# EAGLE design adsr (EAGLE 9.6.2)
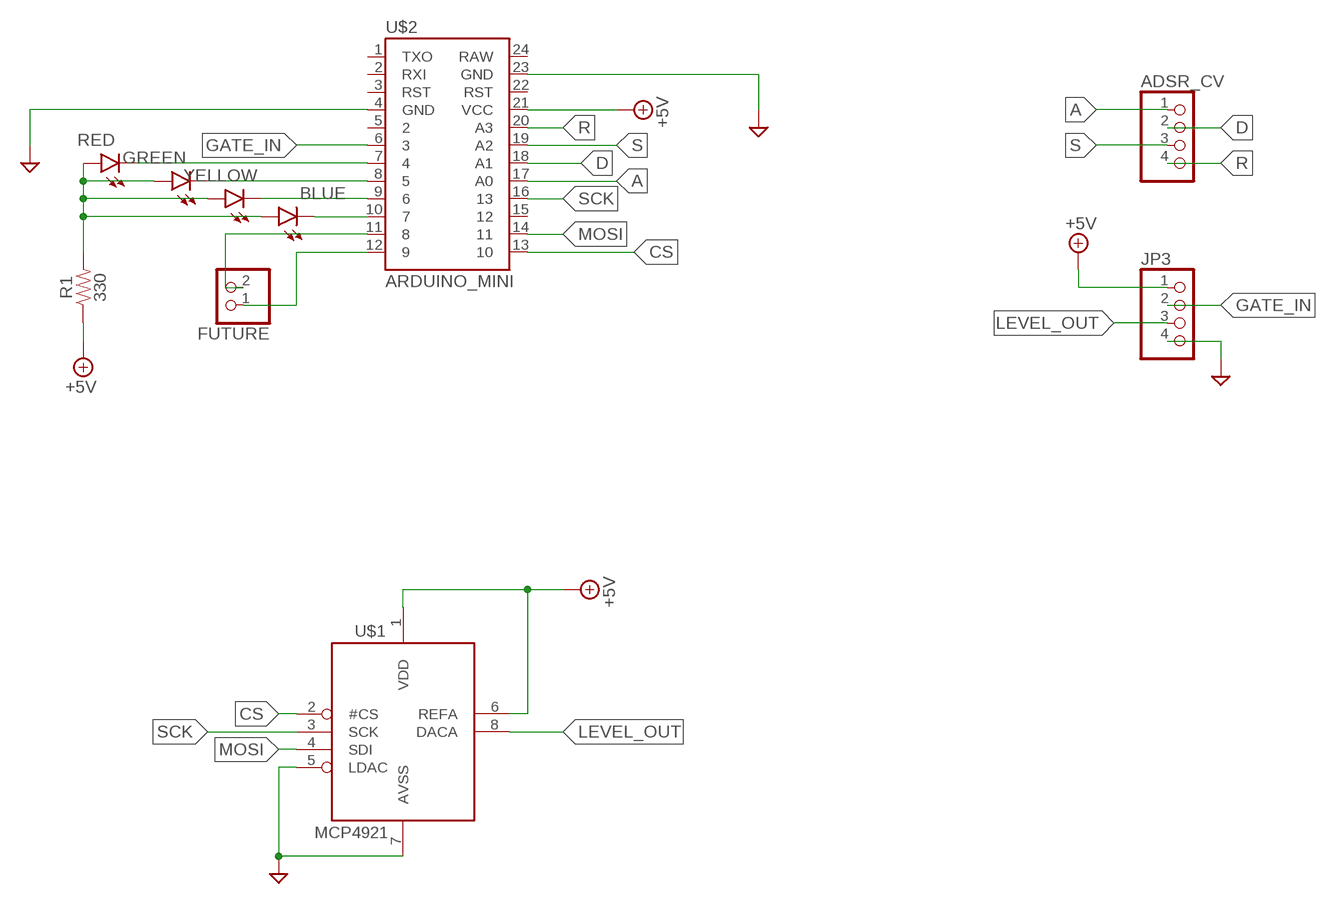
[diagram p0: schematic, sheet 1]

## Parts
ADSR_CV  PINHD-1X4  [1X04]
BLUE  LED-5MM-KIT-NO-SILK  [LED_5MM-KIT-NO-SILK]
FUTURE  PINHD-1X2  [1X02]
GREEN  LED-5MM-KIT-NO-SILK  [LED_5MM-KIT-NO-SILK]
JP3  PINHD-1X4  [1X04]
R1  330  330OHM-HORIZ-1/10W-5%  [AXIAL-0.3]
RED  LED-5MM-KIT-NO-SILK  [LED_5MM-KIT-NO-SILK]
U$1  MCP4921  [DIL08]
U$2  ARDUINO_MINI  [ARDUINO_MINI]
YELLOW  LED-5MM-KIT-NO-SILK  [LED_5MM-KIT-NO-SILK]

## Nets
+5V: JP3.1 R1.P$1 U$1.1(VDD) U$1.6(REFA) U$2.21(VCC)
A: ADSR_CV.1 U$2.17(A0)
CS: U$1.2(#CS) U$2.13
D: ADSR_CV.2 U$2.18(A1)
GATE_IN: JP3.2 U$2.6
GND: JP3.4 U$1.5(LDAC) U$1.7(AVSS) U$2.4(GND) U$2.23(GND)
LEVEL_OUT: JP3.3 U$1.8(DACA)
MOSI: U$1.4(SDI) U$2.14
N$4: BLUE.K(C) U$2.10
N$5: U$2.9 YELLOW.K(C)
N$6: GREEN.K(C) U$2.8
N$7: RED.K(C) U$2.7
N$8: BLUE.A GREEN.A R1.P$2 RED.A YELLOW.A
N$9: FUTURE.2 U$2.11
N$10: FUTURE.1 U$2.12
R: ADSR_CV.4 U$2.20(A3)
S: ADSR_CV.3 U$2.19(A2)
SCK: U$1.3(SCK) U$2.16
Unconnected: U$2.1(TXO) U$2.2(RXI) U$2.3(RST) U$2.5 U$2.15 U$2.22(RST) U$2.24(RAW)

## Library data of the parts
ADSR_CV JP3 = pinhead:PINHD-1X4: PIN HEADER
BLUE GREEN RED YELLOW = SparkFun-LED:LED: LED (Generic) Standard schematic elements and footprints for 5mm, 3mm, 1206, and 0603 sized LEDs. Generic LEDs with no color specified.
FUTURE = pinhead:PINHD-1X2: PIN HEADER
R1 = SparkFun-Resistors:330OHM: 330Ω resistor A resistor is a passive two-terminal electrical component that implements electrical resistance as a circuit element. Resistors act to reduce current flow, and, at the same time, act to lower voltage levels within circuits. - Wikipedia; PROD_ID: RES-8371
U$1 = adafruit:MCP4921
U$2 = SparkFun-Retired:ARDUINO_MINI: Arduino Pro Mini footprint

## Board
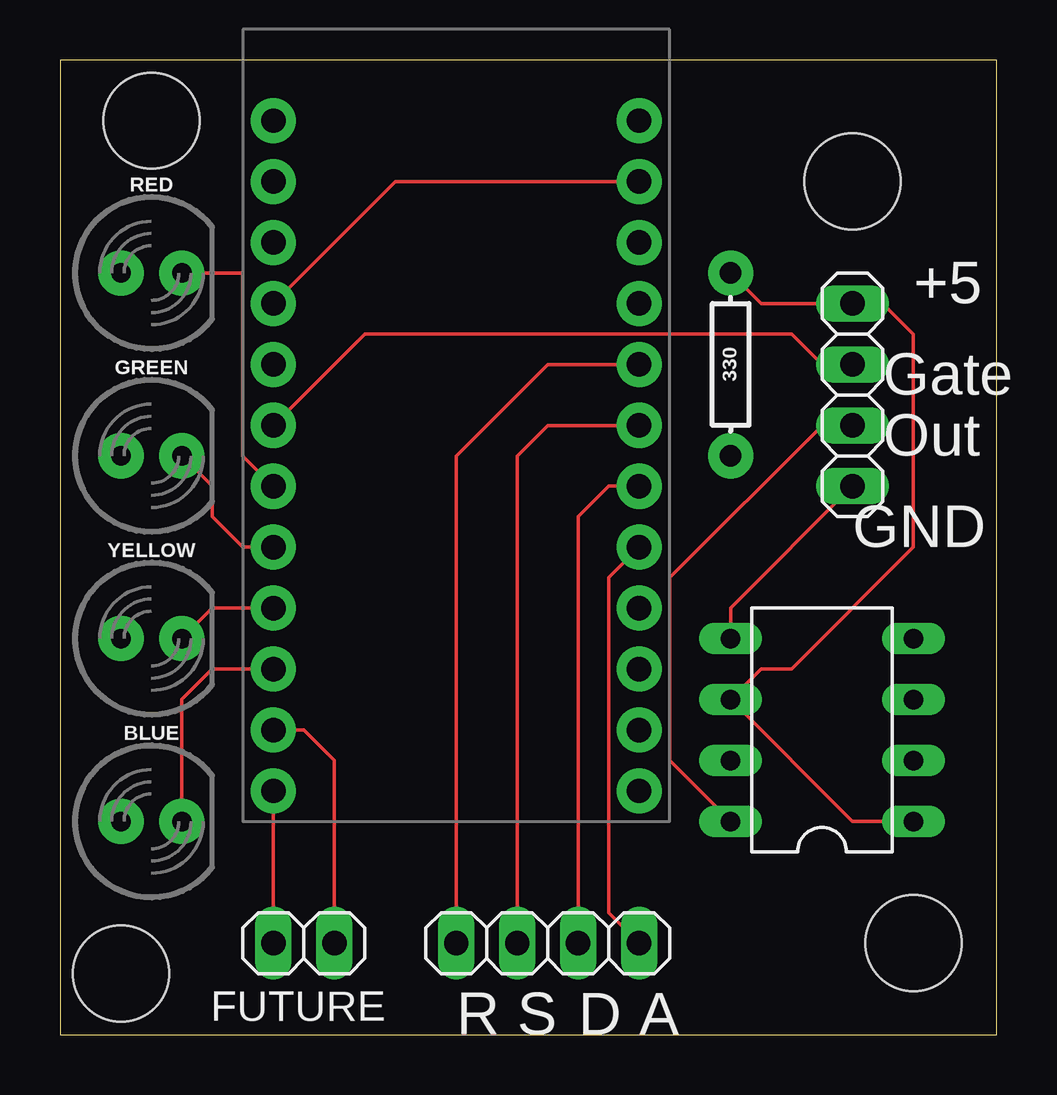
[diagram p1: board, top side]
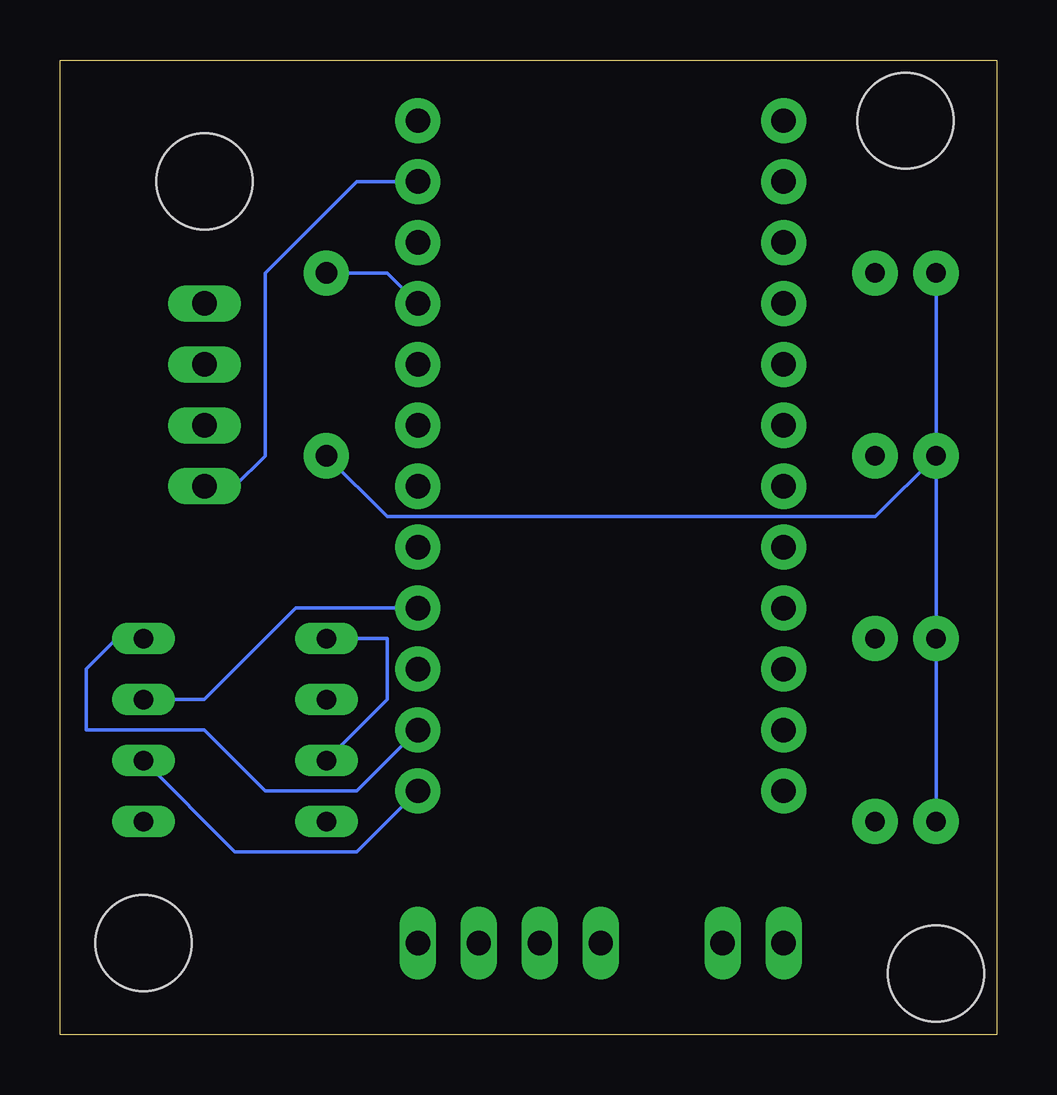
[diagram p2: board, bottom side, seen from below]

Size 39.04 x 40.63 mm. Coordinates in mm from the lower left corner, seen from the top.
Outline: 0,0 39.04,0 39.04,40.63 0,40.63 0,0
Copper layers (1*16): Top 0.035mm / dielectric 1.5mm / Bottom 0.035mm
Design rules "default": minimum track width 6mil, minimum drill 0.35mm, track to track 6mil, track to pad 6mil, pad to pad 6mil, via to via 6mil, smd to smd 6mil, copper to edge 40mil, drill to drill 6mil, minimum pad ring 10mil, minimum via ring 8mil, stop-mask expansion 4mil, vias tented up to drill 0mil, thermal gap 10mil
Holes 4 mm at 3.81,38.1 2.54,2.54 35.56,3.81 33.02,35.56

### Footprints (pad centres in the part's own frame; a part is rotated, then mirrored left to right if it is on the bottom)
1X04 = drill 1.016 long: 1 -3.81,0; 2 -1.27,0; 3 1.27,0; 4 3.81,0
LED_5MM-KIT-NO-SILK = drill 0.813 pad 1.88: A -1.27,0; K 1.27,0
1X02 = drill 1.016 long: 1 -1.27,0; 2 1.27,0
AXIAL-0.3 = drill 0.9 pad 1.88: P$1 -3.81,0; P$2 3.81,0
DIL08 = drill 0.813 long: 1 -3.81,-3.81; 2 -1.27,-3.81; 3 1.27,-3.81; 4 3.81,-3.81; 5 3.81,3.81; 6 1.27,3.81; 7 -1.27,3.81; 8 -3.81,3.81
ARDUINO_MINI = drill 1.016 pad 1.88: 1 -7.62,12.7; 2 -7.62,10.16; 3 -7.62,7.62; 4 -7.62,5.08; 5 -7.62,2.54; 6 -7.62,0; 7 -7.62,-2.54; 8 -7.62,-5.08; 9 -7.62,-7.62; 10 -7.62,-10.16; 11 -7.62,-12.7; 12 -7.62,-15.24; 13 7.62,-15.24; 14 7.62,-12.7; 15 7.62,-10.16; 16 7.62,-7.62; 17 7.62,-5.08; 18 7.62,-2.54; 19 7.62,0; 20 7.62,2.54; 21 7.62,5.08; 22 7.62,7.62; 23 7.62,10.16; 24 7.62,12.7

### Placement (x,y rotation side)
ADSR_CV  20.32,3.81 180 top
BLUE  3.81,8.89 0 top
FUTURE  10.16,3.81 0 top
GREEN  3.81,24.13 0 top
JP3  33.02,26.67 270 top
R1  27.94,27.94 270 top
RED  3.81,31.75 0 top
U$1  31.75,12.7 90 top
U$2  16.51,25.4 0 top
YELLOW  3.81,16.51 0 top

### Tracks (layer width: path | path; a pad name or v marks a point on that pad's centre or on a via)
+5V
  Top 0.152: U$1.1 33.02,8.89 U$1.6 29.21,15.24 30.48,15.24 35.56,20.32 35.56,29.21 34.29,30.48 JP3.1 29.21,30.48 R1.P$1
  Bottom 0.152: U$2.21 25.4,31.75 R1.P$1
A
  Top 0.152: U$2.17 22.86,19.05 22.86,5.08 ADSR_CV.1
CS
  Bottom 0.152: U$1.2 31.75,7.62 26.67,7.62 U$2.13
D
  Top 0.152: ADSR_CV.2 21.59,21.59 22.86,22.86 U$2.18
GATE_IN
  Top 0.152: JP3.2 31.75,27.94 30.48,29.21 12.7,29.21 U$2.6
GND
  Top 0.152: U$2.4 13.97,35.56 U$2.23 | U$1.5 27.94,17.78 JP3.4
  Bottom 0.152: JP3.4 31.75,22.86 30.48,24.13 30.48,31.75 26.67,35.56 U$2.23 | U$1.5 25.4,16.51 25.4,13.97 U$1.7
LEVEL_OUT
  Top 0.152: U$1.8 25.4,11.43 25.4,19.05 31.75,25.4 JP3.3
MOSI
  Bottom 0.152: U$2.14 26.67,10.16 30.48,10.16 33.02,12.7 37.95,12.7 37.95,15.24 36.68,16.51 U$1.4
N$4
  Top 0.152: BLUE.K 5.08,13.97 6.35,15.24 U$2.10
N$5
  Top 0.152: YELLOW.K 6.35,17.78 U$2.9
N$6
  Top 0.152: GREEN.K 6.35,22.86 6.35,21.59 7.62,20.32 U$2.8
N$7
  Top 0.152: RED.K 7.62,31.75 7.62,24.13 U$2.7
N$8
  Bottom 0.152: R1.P$2 25.4,21.59 5.08,21.59 GREEN.A | RED.A GREEN.A | GREEN.A YELLOW.A BLUE.A
N$9
  Top 0.152: U$2.11 10.16,12.7 11.43,11.43 FUTURE.2
N$10
  Top 0.152: FUTURE.1 U$2.12
R
  Top 0.152: ADSR_CV.4 16.51,24.13 20.32,27.94 U$2.20
S
  Top 0.152: ADSR_CV.3 19.05,24.13 20.32,25.4 U$2.19
SCK
  Bottom 0.152: U$1.3 33.02,13.97 29.21,17.78 U$2.16

### Text on the board
tPlace: +5 | Gate | Out | GND | R | S | D | A